# Altium schematic sheet AD7616_BLOCK_A.SchDoc
size A3; SheetNumber: 2; SheetTotal: 16
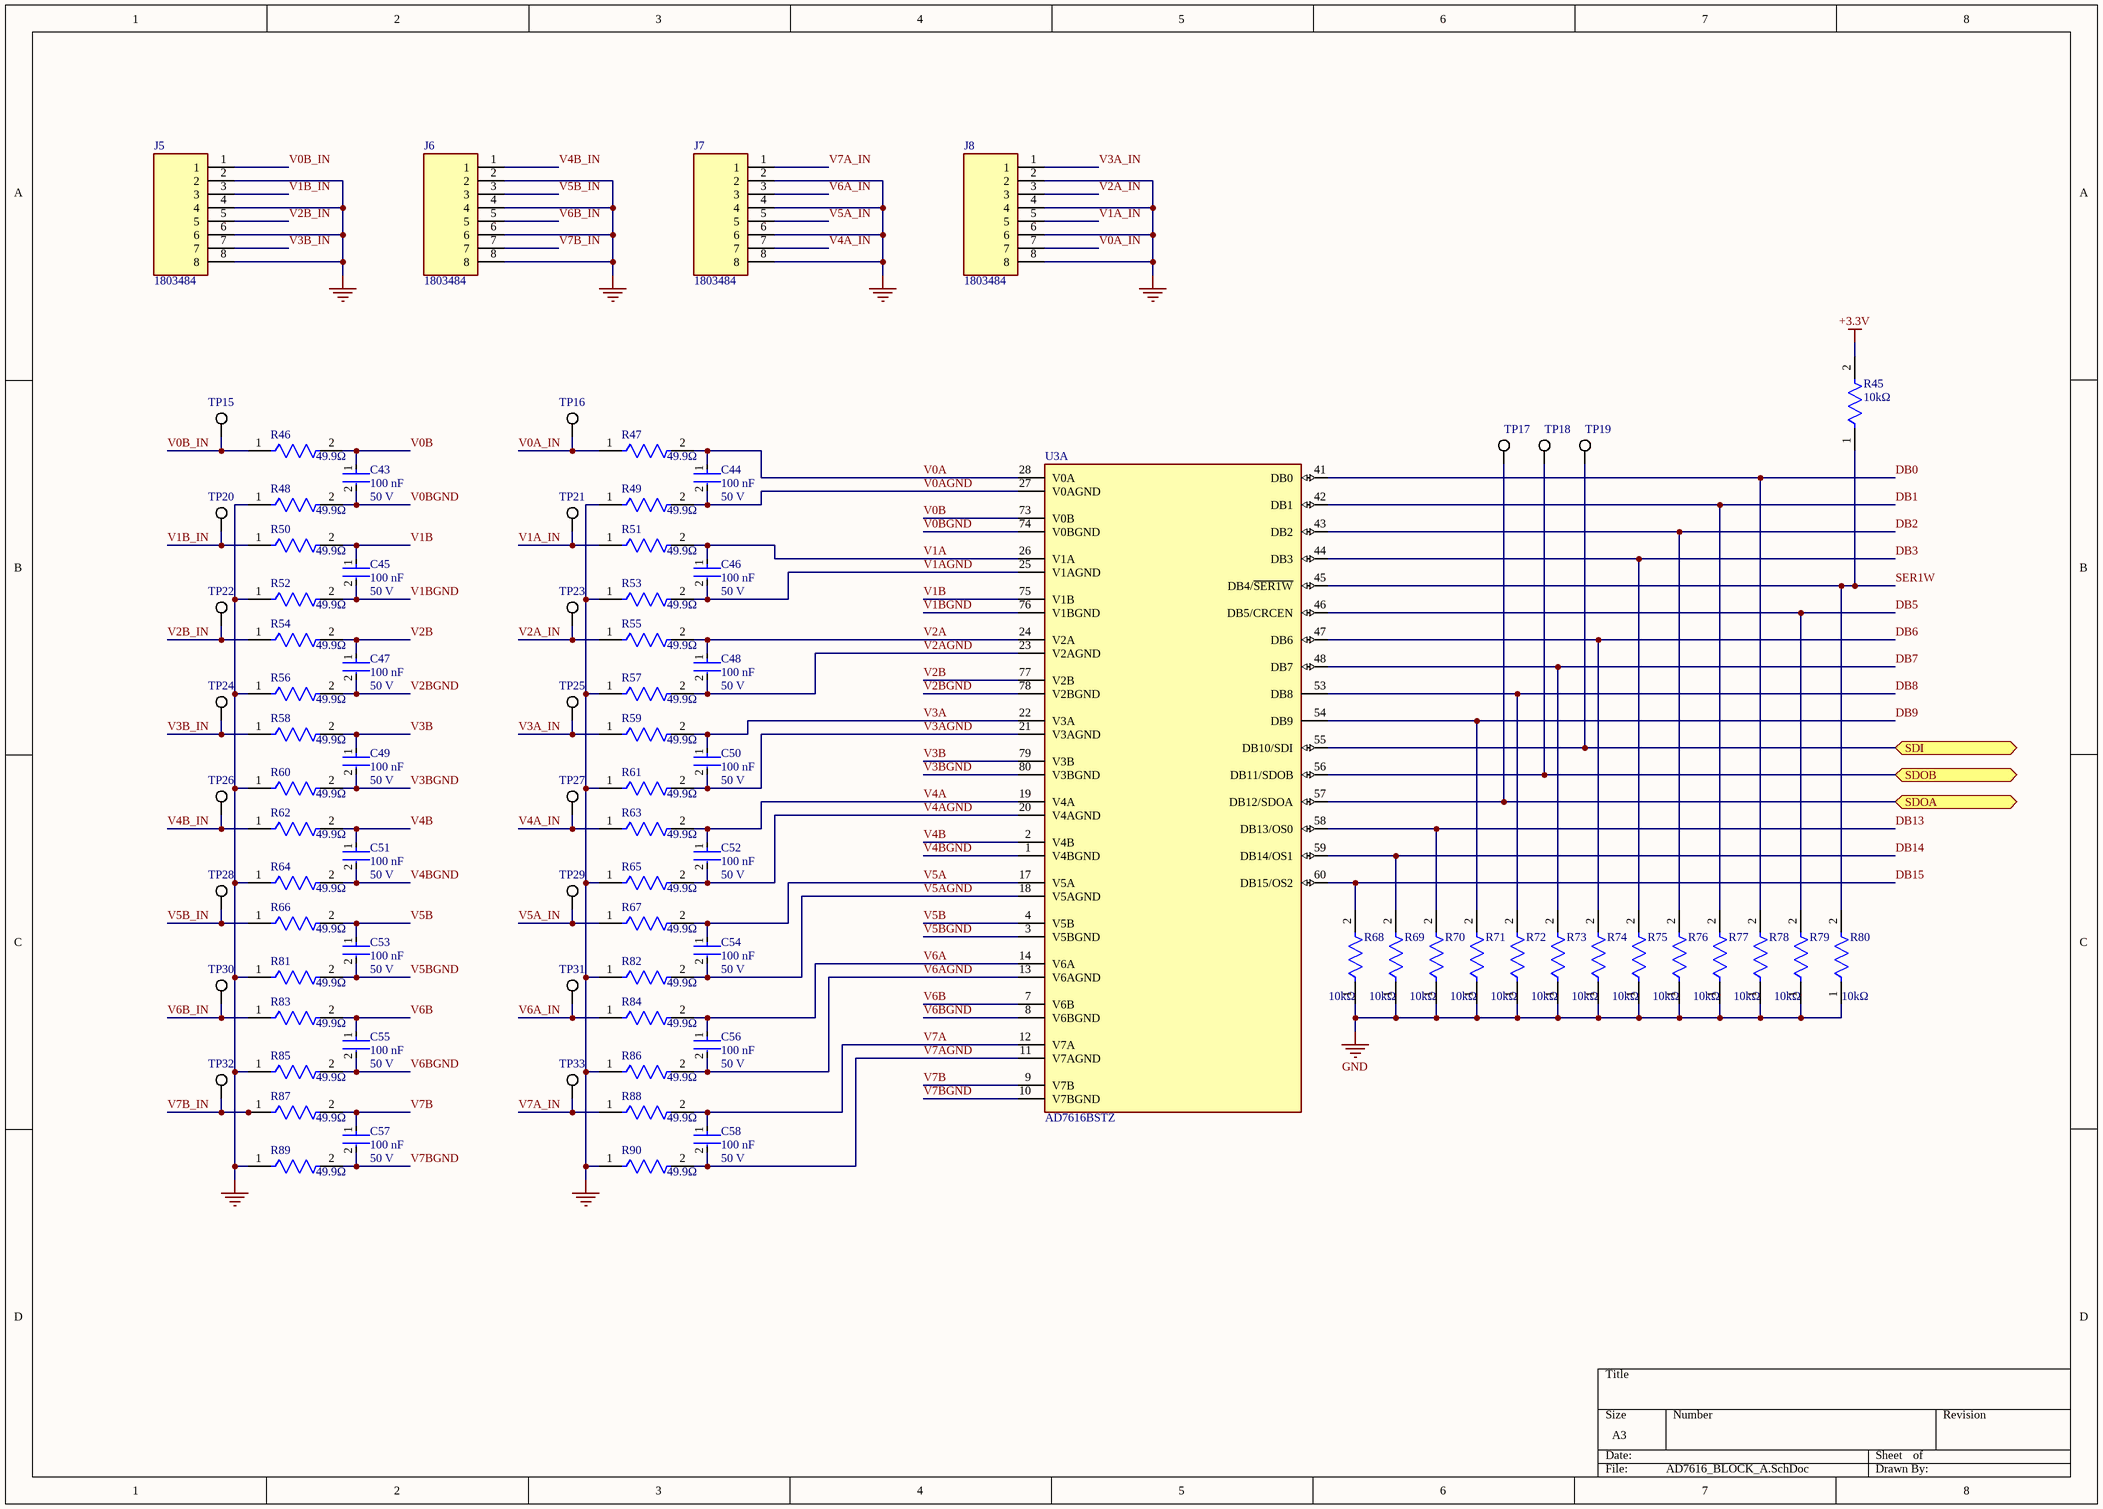
[diagram p0: AD7616_BLOCK_A.SchDoc]

## Parts
C43  value 100 nF  Voltage Rating: 50 V  [FP-C0603C-CF-IPC_B]  (hidden comment: C0603C104M5RACTU)
C44  value 100 nF  Voltage Rating: 50 V  [FP-C0603C-CF-IPC_B]  (hidden comment: C0603C104M5RACTU)
C45  value 100 nF  Voltage Rating: 50 V  [FP-C0603C-CF-IPC_B]  (hidden comment: C0603C104M5RACTU)
C46  value 100 nF  Voltage Rating: 50 V  [FP-C0603C-CF-IPC_B]  (hidden comment: C0603C104M5RACTU)
C47  value 100 nF  Voltage Rating: 50 V  [FP-C0603C-CF-IPC_B]  (hidden comment: C0603C104M5RACTU)
C48  value 100 nF  Voltage Rating: 50 V  [FP-C0603C-CF-IPC_B]  (hidden comment: C0603C104M5RACTU)
C49  value 100 nF  Voltage Rating: 50 V  [FP-C0603C-CF-IPC_B]  (hidden comment: C0603C104M5RACTU)
C50  value 100 nF  Voltage Rating: 50 V  [FP-C0603C-CF-IPC_B]  (hidden comment: C0603C104M5RACTU)
C51  value 100 nF  Voltage Rating: 50 V  [FP-C0603C-CF-IPC_B]  (hidden comment: C0603C104M5RACTU)
C52  value 100 nF  Voltage Rating: 50 V  [FP-C0603C-CF-IPC_B]  (hidden comment: C0603C104M5RACTU)
C53  value 100 nF  Voltage Rating: 50 V  [FP-C0603C-CF-IPC_B]  (hidden comment: C0603C104M5RACTU)
C54  value 100 nF  Voltage Rating: 50 V  [FP-C0603C-CF-IPC_B]  (hidden comment: C0603C104M5RACTU)
C55  value 100 nF  Voltage Rating: 50 V  [FP-C0603C-CF-IPC_B]  (hidden comment: C0603C104M5RACTU)
C56  value 100 nF  Voltage Rating: 50 V  [FP-C0603C-CF-IPC_B]  (hidden comment: C0603C104M5RACTU)
C57  value 100 nF  Voltage Rating: 50 V  [FP-C0603C-CF-IPC_B]  (hidden comment: C0603C104M5RACTU)
C58  value 100 nF  Voltage Rating: 50 V  [FP-C0603C-CF-IPC_B]  (hidden comment: C0603C104M5RACTU)
J5  1803484  [1803484]
J6  1803484  [1803484]
J7  1803484  [1803484]
J8  1803484  [1803484]
R45  Resistance: 10kΩ  [FP-RC0603-0_55-IPC_B]  (hidden comment: RC0603FR-0710KL)
R46  Resistance: 49.9Ω  [FP-AC0603-IPC_B]  (hidden comment: AC0603FR-0749R9L)
R47  Resistance: 49.9Ω  [FP-AC0603-IPC_B]  (hidden comment: AC0603FR-0749R9L)
R48  Resistance: 49.9Ω  [FP-AC0603-IPC_B]  (hidden comment: AC0603FR-0749R9L)
R49  Resistance: 49.9Ω  [FP-AC0603-IPC_B]  (hidden comment: AC0603FR-0749R9L)
R50  Resistance: 49.9Ω  [FP-AC0603-IPC_B]  (hidden comment: AC0603FR-0749R9L)
R51  Resistance: 49.9Ω  [FP-AC0603-IPC_B]  (hidden comment: AC0603FR-0749R9L)
R52  Resistance: 49.9Ω  [FP-AC0603-IPC_B]  (hidden comment: AC0603FR-0749R9L)
R53  Resistance: 49.9Ω  [FP-AC0603-IPC_B]  (hidden comment: AC0603FR-0749R9L)
R54  Resistance: 49.9Ω  [FP-AC0603-IPC_B]  (hidden comment: AC0603FR-0749R9L)
R55  Resistance: 49.9Ω  [FP-AC0603-IPC_B]  (hidden comment: AC0603FR-0749R9L)
R56  Resistance: 49.9Ω  [FP-AC0603-IPC_B]  (hidden comment: AC0603FR-0749R9L)
R57  Resistance: 49.9Ω  [FP-AC0603-IPC_B]  (hidden comment: AC0603FR-0749R9L)
R58  Resistance: 49.9Ω  [FP-AC0603-IPC_B]  (hidden comment: AC0603FR-0749R9L)
R59  Resistance: 49.9Ω  [FP-AC0603-IPC_B]  (hidden comment: AC0603FR-0749R9L)
R60  Resistance: 49.9Ω  [FP-AC0603-IPC_B]  (hidden comment: AC0603FR-0749R9L)
R61  Resistance: 49.9Ω  [FP-AC0603-IPC_B]  (hidden comment: AC0603FR-0749R9L)
R62  Resistance: 49.9Ω  [FP-AC0603-IPC_B]  (hidden comment: AC0603FR-0749R9L)
R63  Resistance: 49.9Ω  [FP-AC0603-IPC_B]  (hidden comment: AC0603FR-0749R9L)
R64  Resistance: 49.9Ω  [FP-AC0603-IPC_B]  (hidden comment: AC0603FR-0749R9L)
R65  Resistance: 49.9Ω  [FP-AC0603-IPC_B]  (hidden comment: AC0603FR-0749R9L)
R66  Resistance: 49.9Ω  [FP-AC0603-IPC_B]  (hidden comment: AC0603FR-0749R9L)
R67  Resistance: 49.9Ω  [FP-AC0603-IPC_B]  (hidden comment: AC0603FR-0749R9L)
R68  Resistance: 10kΩ  [FP-RC0603-0_55-IPC_B]  (hidden comment: RC0603FR-0710KL)
R69  Resistance: 10kΩ  [FP-RC0603-0_55-IPC_B]  (hidden comment: RC0603FR-0710KL)
R70  Resistance: 10kΩ  [FP-RC0603-0_55-IPC_B]  (hidden comment: RC0603FR-0710KL)
R71  Resistance: 10kΩ  [FP-RC0603-0_55-IPC_B]  (hidden comment: RC0603FR-0710KL)
R72  Resistance: 10kΩ  [FP-RC0603-0_55-IPC_B]  (hidden comment: RC0603FR-0710KL)
R73  Resistance: 10kΩ  [FP-RC0603-0_55-IPC_B]  (hidden comment: RC0603FR-0710KL)
R74  Resistance: 10kΩ  [FP-RC0603-0_55-IPC_B]  (hidden comment: RC0603FR-0710KL)
R75  Resistance: 10kΩ  [FP-RC0603-0_55-IPC_B]  (hidden comment: RC0603FR-0710KL)
R76  Resistance: 10kΩ  [FP-RC0603-0_55-IPC_B]  (hidden comment: RC0603FR-0710KL)
R77  Resistance: 10kΩ  [FP-RC0603-0_55-IPC_B]  (hidden comment: RC0603FR-0710KL)
R78  Resistance: 10kΩ  [FP-RC0603-0_55-IPC_B]  (hidden comment: RC0603FR-0710KL)
R79  Resistance: 10kΩ  [FP-RC0603-0_55-IPC_B]  (hidden comment: RC0603FR-0710KL)
R80  Resistance: 10kΩ  [FP-RC0603-0_55-IPC_B]  (hidden comment: RC0603FR-0710KL)
R81  Resistance: 49.9Ω  [FP-AC0603-IPC_B]  (hidden comment: AC0603FR-0749R9L)
R82  Resistance: 49.9Ω  [FP-AC0603-IPC_B]  (hidden comment: AC0603FR-0749R9L)
R83  Resistance: 49.9Ω  [FP-AC0603-IPC_B]  (hidden comment: AC0603FR-0749R9L)
R84  Resistance: 49.9Ω  [FP-AC0603-IPC_B]  (hidden comment: AC0603FR-0749R9L)
R85  Resistance: 49.9Ω  [FP-AC0603-IPC_B]  (hidden comment: AC0603FR-0749R9L)
R86  Resistance: 49.9Ω  [FP-AC0603-IPC_B]  (hidden comment: AC0603FR-0749R9L)
R87  Resistance: 49.9Ω  [FP-AC0603-IPC_B]  (hidden comment: AC0603FR-0749R9L)
R88  Resistance: 49.9Ω  [FP-AC0603-IPC_B]  (hidden comment: AC0603FR-0749R9L)
R89  Resistance: 49.9Ω  [FP-AC0603-IPC_B]  (hidden comment: AC0603FR-0749R9L)
R90  Resistance: 49.9Ω  [FP-AC0603-IPC_B]  (hidden comment: AC0603FR-0749R9L)
TP15  5019  [KSTN-5019_V]  (value not drawn)
TP16  5019  [KSTN-5019_V]  (value not drawn)
TP17  5019  [KSTN-5019_V]  (value not drawn)
TP18  5019  [KSTN-5019_V]  (value not drawn)
TP19  5019  [KSTN-5019_V]  (value not drawn)
TP20  5019  [KSTN-5019_V]  (value not drawn)
TP21  5019  [KSTN-5019_V]  (value not drawn)
TP22  5019  [KSTN-5019_V]  (value not drawn)
TP23  5019  [KSTN-5019_V]  (value not drawn)
TP24  5019  [KSTN-5019_V]  (value not drawn)
TP25  5019  [KSTN-5019_V]  (value not drawn)
TP26  5019  [KSTN-5019_V]  (value not drawn)
TP27  5019  [KSTN-5019_V]  (value not drawn)
TP28  5019  [KSTN-5019_V]  (value not drawn)
TP29  5019  [KSTN-5019_V]  (value not drawn)
TP30  5019  [KSTN-5019_V]  (value not drawn)
TP31  5019  [KSTN-5019_V]  (value not drawn)
TP32  5019  [KSTN-5019_V]  (value not drawn)
TP33  5019  [KSTN-5019_V]  (value not drawn)
U3  AD7616BSTZ  [FP-ST-80-2-IPC_B]  (part A of 2)

## Ports
SDI (bidir), SDOA (bidir), SDOB (bidir)

## Nets
+3.3V: R45.2
GND: J5.2 J5.4 J5.6 J5.8 J6.2 J6.4 J6.6 J6.8 J7.2 J7.4 J7.6 J7.8 J8.2 J8.4 J8.6 J8.8 R48.1 R49.1 R52.1 R53.1 R56.1 R57.1 R60.1 R61.1 R64.1 R65.1 R68.1 R69.1 R70.1 R71.1 R72.1 R73.1 R74.1 R75.1 R76.1 R77.1 R78.1 R79.1 R80.1 R81.1 R82.1 R85.1 R86.1 R89.1 R90.1
DB0: R78.2 U3.41(DB0)
DB1: R77.2 U3.42(DB1)
DB2: R76.2 U3.43(DB2)
DB3: R75.2 U3.44(DB3)
DB5: R79.2 U3.46(DB5/CRCEN)
DB6: R74.2 U3.47(DB6)
DB7: R73.2 U3.48(DB7)
DB8: R72.2 U3.53(DB8)
DB9: R71.2 U3.54(DB9)
DB13: R70.2 U3.58(DB13/OS0)
DB14: R69.2 U3.59(DB14/OS1)
DB15: R68.2 U3.60(DB15/OS2)
SDI: TP19.1 U3.55(DB10/SDI) ; port SDI
SDOA: TP17.1 U3.57(DB12/SDOA) ; port SDOA
SDOB: TP18.1 U3.56(DB11/SDOB) ; port SDOB
SER1W: R45.1 R80.2 U3.45(DB4/~{SER1W})
V0A: C44.1 R47.2 U3.28(V0A)
V0A_IN: J8.7 R47.1 TP16.1
V0AGND: C44.2 R49.2 U3.27(V0AGND)
V0B: C43.1 R46.2 U3.73(V0B)
V0B_IN: J5.1 R46.1 TP15.1
V0BGND: C43.2 R48.2 U3.74(V0BGND)
V1A: C46.1 R51.2 U3.26(V1A)
V1A_IN: J8.5 R51.1 TP21.1
V1AGND: C46.2 R53.2 U3.25(V1AGND)
V1B: C45.1 R50.2 U3.75(V1B)
V1B_IN: J5.3 R50.1 TP20.1
V1BGND: C45.2 R52.2 U3.76(V1BGND)
V2A: C48.1 R55.2 U3.24(V2A)
V2A_IN: J8.3 R55.1 TP23.1
V2AGND: C48.2 R57.2 U3.23(V2AGND)
V2B: C47.1 R54.2 U3.77(V2B)
V2B_IN: J5.5 R54.1 TP22.1
V2BGND: C47.2 R56.2 U3.78(V2BGND)
V3A: C50.1 R59.2 U3.22(V3A)
V3A_IN: J8.1 R59.1 TP25.1
V3AGND: C50.2 R61.2 U3.21(V3AGND)
V3B: C49.1 R58.2 U3.79(V3B)
V3B_IN: J5.7 R58.1 TP24.1
V3BGND: C49.2 R60.2 U3.80(V3BGND)
V4A: C52.1 R63.2 U3.19(V4A)
V4A_IN: J7.7 R63.1 TP27.1
V4AGND: C52.2 R65.2 U3.20(V4AGND)
V4B: C51.1 R62.2 U3.2(V4B)
V4B_IN: J6.1 R62.1 TP26.1
V4BGND: C51.2 R64.2 U3.1(V4BGND)
V5A: C54.1 R67.2 U3.17(V5A)
V5A_IN: J7.5 R67.1 TP29.1
V5AGND: C54.2 R82.2 U3.18(V5AGND)
V5B: C53.1 R66.2 U3.4(V5B)
V5B_IN: J6.3 R66.1 TP28.1
V5BGND: C53.2 R81.2 U3.3(V5BGND)
V6A: C56.1 R84.2 U3.14(V6A)
V6A_IN: J7.3 R84.1 TP31.1
V6AGND: C56.2 R86.2 U3.13(V6AGND)
V6B: C55.1 R83.2 U3.7(V6B)
V6B_IN: J6.5 R83.1 TP30.1
V6BGND: C55.2 R85.2 U3.8(V6BGND)
V7A: C58.1 R88.2 U3.12(V7A)
V7A_IN: J7.1 R88.1 TP33.1
V7AGND: C58.2 R90.2 U3.11(V7AGND)
V7B: C57.1 R87.2 U3.9(V7B)
V7B_IN: J6.7 R87.1 TP32.1
V7BGND: C57.2 R89.2 U3.10(V7BGND)

## Library data of the parts
C43-C58 = CMP-2006-03068-2: CAP CER 0.1UF 50V 20% X7R 0603; Manufacturer: KEMET; Material: Ceramic; Tolerance: 0.2; Temperature Coefficient: 30ppm/°C; Automotive Grade: Grade 1; Capacitance: 0.10 μF; Temperature Range High: +125°C; Device Class L3: Ceramic Capacitors; Manufacturer Part Number: C0603C104M5RACTU; Height: 0.87mm; Category: Cap; RoHS: TRUE; Digikey Description: CAP CER 0.1UF 50V 20% X7R 0603; ComponentLink2URL: https://api.kemet.com/component-edge/download/datasheet/C0603C100J5GACAUTO.pdf; Lead Free: Yes; Temperature Range Low: -55°C; Device Class L1: Passive Components; ComponentLink2Description: Datasheet; Temperature Characteristic: X7R; Automotive: Yes; Temperature: -55°C to +125°C; Octopart: https://octopart.com/c0603c104m5ractu-kemet-11855687; Device Class L2: Capacitors; Package: C0603C-CF; Mouser Description: Multilayer Ceramic Capacitors MLCC - SMD/SMT 50volts 0.1uF X7R 20%
J5-J8 = 1803484: Connector; Manufacturer_Name: Phoenix Contact; Datasheet Link: http://www.phoenixcontact.com/de/produkte/1803484/pdf; Height: 9.35mm; Manufacturer_Part_Number: 1803484; Mouser Part Number: 651-1803484; Mouser Price/Stock: https://www.mouser.co.uk/ProductDetail/Phoenix-Contact/1803484?qs=Xflg4jNzfa48adyRRbAz9g%3D%3D; Arrow Part Number: 1803484; Arrow Price/Stock: https://www.arrow.com/en/products/1803484/phoenix-contact?region=nac
R45 R68-R80 = CMP-2100-03664-2: RES 10K OHM 1% 1/10W 0603; Voltage Rating: 75V; Voltage Rating (DC): 50V; Power Rating: 100mW; Temperature Coefficient: 100ppm/°C; Depth: 0.8mm; Termination: SMD/SMT; Resistor Type: Thick Film; Series: RC; Construction: Rectangular; Features: Moisture Resistant; Packaging: Tape and Reel; Min Operating Temperature: -55°C; Number of Terminations: 2; Lead Pitch: 0.3mm; RoHS Compliant: Yes; Case/Package: 0603; Resistance Tolerance: 1%; Military Standard: Not; Weight: 7.1E-05oz; Number of Pins: 2; Tolerance: 1%; Length: 1.6mm; Case Code (Imperial): 0603; Lead Free: Lead Free; Width: 0.8mm; Max Power Dissipation: 100mW; Height: 0.45mm; Max Operating Temperature: 155°C; Case Code (Metric): 1608; Size Code: 0603
R46-R67 R81-R90 = CMP-03412-018485-2: RES 49.9Ω 1.00% 0.1W 0603; Temperature Coefficient: 100ppm/°C; Max Power Dissipation: 100mW; Voltage Rating: 50V; Tolerance: 1%; Series: AC; Case Code (Imperial): 0603; Features: Moisture Resistant; Case/Package: 0603; Width: 0.8mm; Case Code (Metric): 1608; Termination: SMD/SMT; Number of Terminations: 2; Power Rating: 100mW; RoHS Compliant: Yes; Height: 0.022inch; Min Operating Temperature: -55°C; Ratings: AEC-Q200; Packaging: Tape and Reel; Max Operating Temperature: 155°C; Resistor Type: Thick Film; Length: 0.063inch; Construction: Rectangular; Depth: 0.8mm; Military Standard: Not
TP15-TP33 = CMP-1672-00008-1: Test Point, 1 Position SMD, RoHS, Tape and Reel; ComponentLink1Description: Manufacturer URL; Package Quantity: 1000; DatasheetVersion: 03/2014; Packaging: Tape and Reel; ComponentLink2URL: http://www.keyelco.com/product-pdf.cfm?p=1357; ComponentLink1URL: http://www.keyelco.com/; Mount: Surface Mount; Contact Plating: Silver; PackageDescription: 1-Pin Surface Mount Device, Body 3.81 x 2.03 mm; Pins: 1; RoHSCompliant: True; Mounting Technology: Surface Mount; ComponentLink2Description: Datasheet; PackageReference: 5019
U3 = CMP-09081-000018-1: IC ADC 16BIT SAR 80LQFP; Number of A/D Converters: 2; Interface: SPI; Sampling Rate: 1000000S/s; Number of Bits: 16; RoHS Compliant: Yes; Max Operating Temperature: 125°C; Case/Package: LQFP; Lead Free: Contains Lead; Min Operating Temperature: -40°C; Number of Pins: 80; Number of Inputs: 16; Packaging: Tray